# Altium schematic sheet WL-SBORKA.SchDoc
size 420 x 297 mm; Address1: Address1; Address2: Address2; Address3: Address3; Address4: Address4; DocumentNumber: ТРАНСИВЕР «ВОЛК»; SheetNumber: 1; Scale: 1:1; DocumentType: Схема электрическая принципиальная; FirstReferrence: АБВГ.123456.001
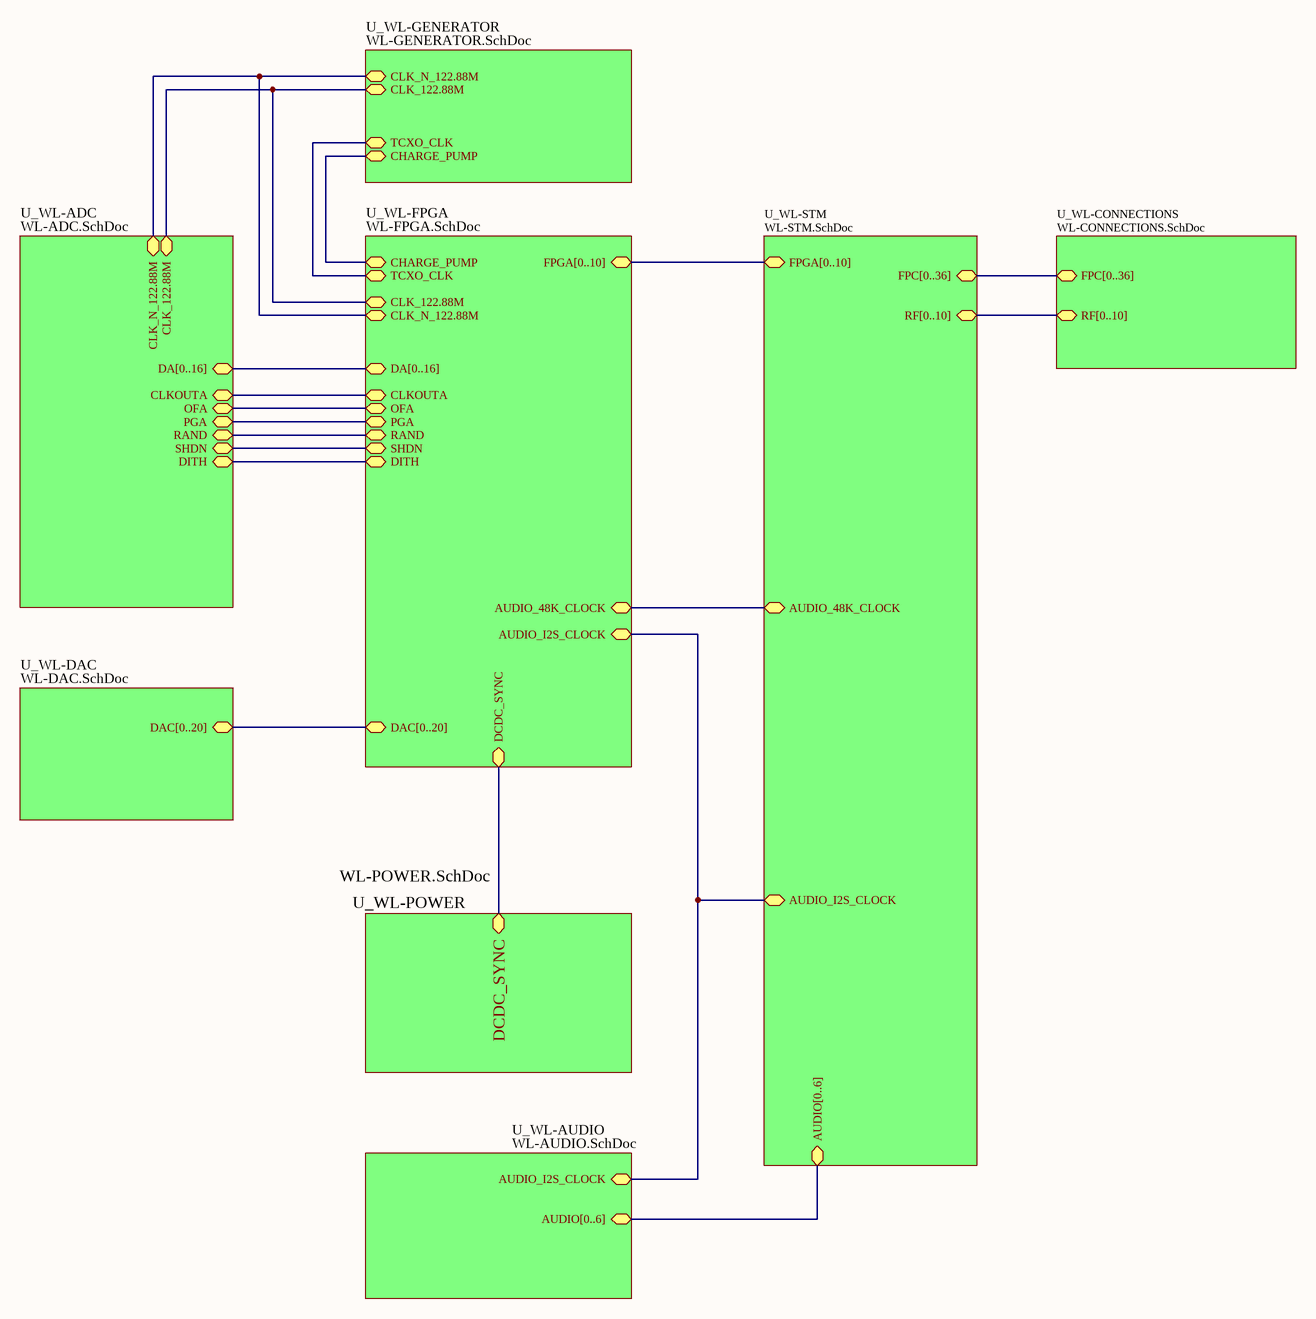
[diagram p0: WL-SBORKA.SchDoc]

## Sub-sheets
U_WL-ADC = WL-ADC.SchDoc: PGA (bidir), CLKOUTA (bidir), OFA (bidir), DA[0..16] (bidir), CLK_N_122.88M (bidir), CLK_122.88M (bidir), RAND (bidir), SHDN (bidir), DITH (bidir)
U_WL-AUDIO = WL-AUDIO.SchDoc: AUDIO[0..6] (bidir), AUDIO_I2S_CLOCK (bidir)
U_WL-CONNECTIONS = WL-CONNECTIONS.SchDoc: FPC[0..36] (bidir), RF[0..10] (bidir)
U_WL-DAC = WL-DAC.SchDoc: DAC[0..20] (bidir)
U_WL-FPGA = WL-FPGA.SchDoc: DA[0..16] (bidir), FPGA[0..10] (bidir), DAC[0..20] (bidir), CLK_122.88M (bidir), CLK_N_122.88M (bidir), CHARGE_PUMP (bidir), AUDIO_48K_CLOCK (bidir), RAND (bidir), SHDN (bidir), DITH (bidir), PGA (bidir), CLKOUTA (bidir), OFA (bidir), TCXO_CLK (bidir), DCDC_SYNC (bidir), AUDIO_I2S_CLOCK (bidir)
U_WL-GENERATOR = WL-GENERATOR.SchDoc: CLK_N_122.88M (bidir), CLK_122.88M (bidir), CHARGE_PUMP (bidir), TCXO_CLK (bidir)
U_WL-POWER = WL-POWER.SchDoc: DCDC_SYNC (bidir)
U_WL-STM = WL-STM.SchDoc: FPGA[0..10] (bidir), AUDIO_48K_CLOCK (bidir), AUDIO_I2S_CLOCK (bidir), AUDIO[0..6] (bidir), FPC[0..36] (bidir), RF[0..10] (bidir)

## Nets
(unnamed): sheet U_WL-FPGA/CLK_122.88M, sheet U_WL-ADC/CLK_122.88M, sheet U_WL-GENERATOR/CLK_122.88M
(unnamed): sheet U_WL-FPGA/CLK_N_122.88M, sheet U_WL-ADC/CLK_N_122.88M, sheet U_WL-GENERATOR/CLK_N_122.88M
(unnamed): sheet U_WL-FPGA/CHARGE_PUMP, sheet U_WL-GENERATOR/CHARGE_PUMP
(unnamed): sheet U_WL-FPGA/AUDIO_48K_CLOCK, sheet U_WL-STM/AUDIO_48K_CLOCK
(unnamed): sheet U_WL-FPGA/RAND, sheet U_WL-ADC/RAND
(unnamed): sheet U_WL-FPGA/SHDN, sheet U_WL-ADC/SHDN
(unnamed): sheet U_WL-FPGA/DITH, sheet U_WL-ADC/DITH
(unnamed): sheet U_WL-FPGA/PGA, sheet U_WL-ADC/PGA
(unnamed): sheet U_WL-FPGA/CLKOUTA, sheet U_WL-ADC/CLKOUTA
(unnamed): sheet U_WL-FPGA/OFA, sheet U_WL-ADC/OFA
(unnamed): sheet U_WL-FPGA/TCXO_CLK, sheet U_WL-GENERATOR/TCXO_CLK
(unnamed): sheet U_WL-FPGA/DCDC_SYNC, sheet U_WL-POWER/DCDC_SYNC
(unnamed): sheet U_WL-FPGA/AUDIO_I2S_CLOCK, sheet U_WL-STM/AUDIO_I2S_CLOCK, sheet U_WL-AUDIO/AUDIO_I2S_CLOCK

## Buses and harness runs
bus sheet U_WL-ADC/DA[0..16] = sheet U_WL-FPGA/DA[0..16]
bus sheet U_WL-AUDIO/AUDIO[0..6] = sheet U_WL-STM/AUDIO[0..6]
bus sheet U_WL-CONNECTIONS/FPC[0..36] = sheet U_WL-STM/FPC[0..36]
bus sheet U_WL-CONNECTIONS/RF[0..10] = sheet U_WL-STM/RF[0..10]
bus sheet U_WL-DAC/DAC[0..20] = sheet U_WL-FPGA/DAC[0..20]
bus sheet U_WL-FPGA/FPGA[0..10] = sheet U_WL-STM/FPGA[0..10]

## Notes on the sheet
- Подп. и дата
- Инв. № дубл.
- Взам. инв. №
- Инв. № подл.
- Изм.
- Лист
- № докум.
- Подп.
- Дата
- 2.106-A3
- Копировал
- Формат А3